# Altium schematic sheet smartpot第三版.SchDoc: Flowerpot
size A3
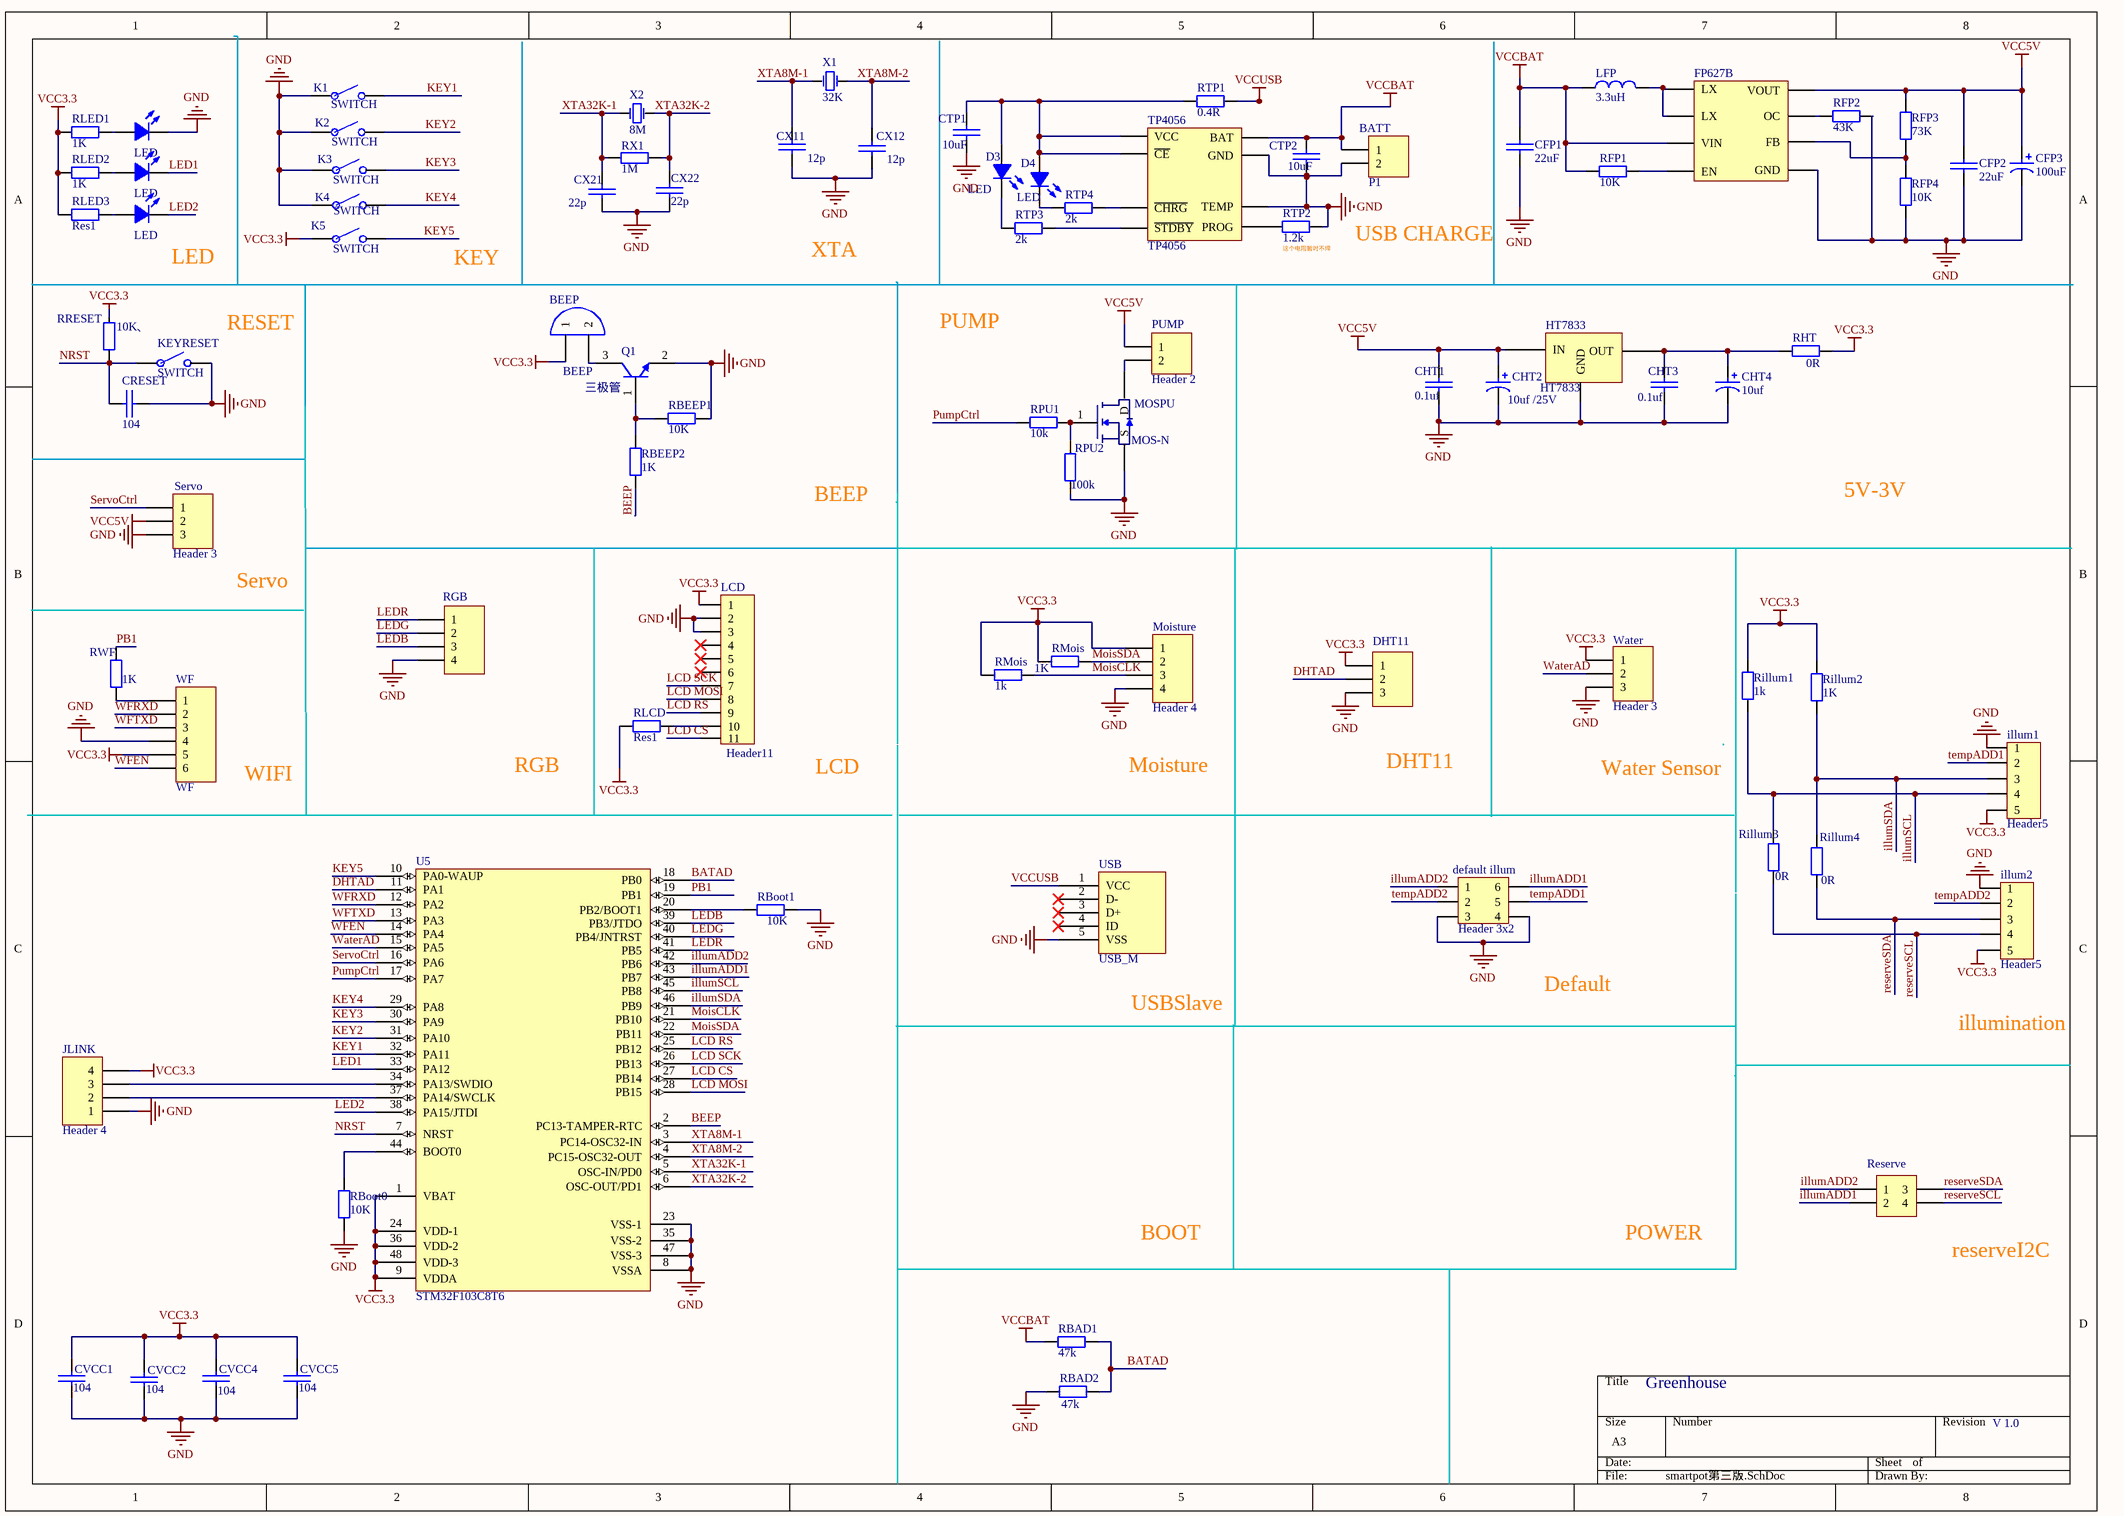
[diagram p0: smartpot第三版.SchDoc]

## Parts
(Parts that share a designator on the sheet are numbered #1, #2 ... from top to bottom, then left to right.)
BEEP  BEEP  [BEEP]
CFP1  22uF  [0603-1]
CFP2  22uF  [0603-1]
CFP3  100uF  [1206 - J]
CHT1  0.1uf  [0603-1]
CHT2  10uf /25V  [1206 - J]
CHT3  0.1uf  [0603-1]
CHT4  10uf  [1206 - J]
CRESET  104  [0603-1]
CTP1  10uF  [0603-1]
CTP2  10uF  [0603-1]
CVCC1  104  [0603-1]
CVCC2  104  [0603-1]
CVCC4  104  [0603-1]
CVCC5  104  [0603-1]
CX11  12p  [0603-1]
CX12  12p  [0603-1]
CX21  22p  [0603-1]
CX22  22p  [0603-1]
D1  LED  [LED-0805]
D2  LED  [LED-0805]
D3  LED  [LED-0805]
D4  LED  [LED-0805]
D5  LED  [LED-0805]
default_illum  Header 3x2  [HDR3X2 A]
DHT11  Header 3  [HDR3X1_DHT]  (value not drawn)
FP627B  (no value)  [NSO8_TP4056]
HT7833  HT7833  [SOT-89-3]
illum1  Header5  [HDR5x1 A1]
illum2  Header5  [HDR5x1 A1]
JLINK  Header 4  [header 4]
K1  SWITCH  [SWITCH-1]
K2  SWITCH  [SWITCH-1]
K3  SWITCH  [SWITCH-1]
K4  SWITCH  [SWITCH-1]
K5  SWITCH  [SWITCH-1]
KEYRESET  SWITCH  [SWITCH-1]
LCD  Header11  [HDR11X1_A]
LFP  3.3uH  [0805-1]
Moisture  Header 4  [header 4]
MOSPU  MOS-N  [SOT-23]
P1  BATT  [HDR2X1_A]
PUMP  Header 2  [HDR2X1_A]
Q1  三极管  [SOT-23]
RBAD1  47k  [0603]
RBAD2  47k  [0603]
RBEEP1  10K  [0603]
RBEEP2  1K  [0603]
RBoot0  value 10K  [0603]  (hidden comment: Res1)
RBoot1  value 10K  [0603]  (hidden comment: Res1)
Reserve  Header 2X2B  [HDR2X2_B]  (value not drawn)
RFP1  10K  [0603]
RFP2  43K  [0603]
RFP3  73K  [0603]
RFP4  10K  [0603]
RGB  Header 4  [HDR4X1_B2]  (value not drawn)
RHT  0R  [0603]
Rillum1  1k  [0603]
Rillum2  1K  [0603]
Rillum3  0R  [0603]
Rillum4  0R  [0603]
RLCD  Res1  [0603]
RLED1  1K  [0603]
RLED2  1K  [0603]
RLED3  Res1  [0603]
RMois#1  1K  [0603]
RMois#2  1k  [0603]
RPU1  10k  [0603]
RPU2  100k  [0603]
RRESET  10K、  [0603]
RTP1  0.4R  [0603]
RTP2  1.2k  [0603]
RTP3  2k  [0603]
RTP4  2k  [0603]
RWF  1K  [0603]
RX1  1M  [0603]
Servo  Header 3  [HDR3X1_A]
TP4056  TP4056  [NSO8_TP4056]
U5  STM32F103C8T6  [LQFP-48]
USB  USB_M  [USB_MICRO]
Water  Header 3  [HDR3X1_A]
WF  WF  [HDR6X1_WF]
X1  32K  [XTAL - Y]
X2  8M  [XTAL]

## Nets
GND: CFP1.1 CFP2.1 CFP3.2 CHT1.1 CHT2.2 CHT3.1 CHT4.2 CRESET.2 CTP1.1 CTP2.1 CVCC1.1 CVCC2.1 CVCC4.1 CVCC5.1 CX11.1 CX12.1 CX21.1 CX22.1 D1.2(K) default_illum.3 default_illum.4 DHT11.3 FP627B.5(GND) HT7833.1(GND) illum1.1 illum2.1 JLINK.1 K1.1 K2.1 K3.1 K4.1 KEYRESET.2 LCD.2 LCD.3 Moisture.4 MOSPU.2(S) P1.2 Q1.2(E) RBAD2.1 RBEEP1.1 RBoot0.1 RBoot1.2 RFP2.2 RFP4.1 RGB.4 RPU2.1 RTP2.2 Servo.3 TP4056.1(TEMP) TP4056.3(GND) U5.8(VSSA) U5.23(VSS-1) U5.35(VSS-2) U5.47(VSS-3) USB.5(VSS) Water.3 WF.4
VCC3.3: BEEP.1 CVCC1.2 CVCC2.2 CVCC4.2 CVCC5.2 DHT11.1 illum1.5 illum2.5 JLINK.4 K5.1 LCD.1 Moisture.1 RHT.2 Rillum1.2 Rillum2.2 RLCD.1 RLED1.1 RLED2.1 RLED3.1 RMois#1.1 RMois#2.2 RRESET.2 U5.1(VBAT) U5.9(VDDA) U5.24(VDD-1) U5.36(VDD-2) U5.48(VDD-3) Water.1 WF.5
VCC5V: CFP2.2 CFP3.1 CHT1.2 CHT2.1 FP627B.8(VOUT) HT7833.2(IN) PUMP.1 RFP3.2 Servo.2
VCCBAT: CFP1.2 CTP2.2 FP627B.3(VIN) LFP.1 P1.1 RBAD1.1 RFP1.1 TP4056.5(BAT)
VCCUSB: RTP1.2 USB.1(VCC)
BATAD: RBAD1.2 RBAD2.2 U5.18(PB0)
BEEP: RBEEP2.1 U5.2(PC13-TAMPER-RTC)
DHTAD: DHT11.2 U5.11(PA1)
illumADD1: default_illum.6 Reserve.2 U5.43(PB7)
illumADD2: default_illum.1 Reserve.1 U5.42(PB6)
illumSCL: illum1.4 Rillum1.1 Rillum3.2 U5.45(PB8)
illumSDA: illum1.3 Rillum2.1 Rillum4.2 U5.46(PB9)
KEY1: K1.2 U5.32(PA11)
KEY2: K2.2 U5.31(PA10)
KEY3: K3.2 U5.30(PA9)
KEY4: K4.2 U5.29(PA8)
KEY5: K5.2 U5.10(PA0-WAUP)
LCD CS: LCD.11 U5.27(PB14)
LCD MOSI: LCD.8 U5.28(PB15)
LCD RS: LCD.9 U5.25(PB12)
LCD SCK: LCD.7 U5.26(PB13)
LED1: D2.2(K) U5.33(PA12)
LED2: D5.2(K) U5.38(PA15/JTDI)
LEDB: RGB.3 U5.39(PB3/JTDO)
LEDG: RGB.2 U5.40(PB4/JNTRST)
LEDR: RGB.1 U5.41(PB5)
MoisCLK: Moisture.3 RMois#2.1 U5.21(PB10)
MoisSDA: Moisture.2 RMois#1.2 U5.22(PB11)
NRST: CRESET.1 KEYRESET.1 RRESET.1 U5.7(NRST)
PB1: RWF.2 U5.19(PB1)
PumpCtrl: RPU1.1 U5.17(PA7)
reserveSCL: illum2.4 Reserve.4 Rillum3.1
reserveSDA: illum2.3 Reserve.3 Rillum4.1
ServoCtrl: Servo.1 U5.16(PA6)
tempADD1: default_illum.5 illum1.2
tempADD2: default_illum.2 illum2.2
WaterAD: U5.15(PA5) Water.2
WFEN: U5.14(PA4) WF.6
WFRXD: U5.12(PA2) WF.2
WFTXD: U5.13(PA3) WF.3
XTA8M-1: CX11.2 U5.3(PC14-OSC32-IN) X1.1
XTA8M-2: CX12.2 U5.4(PC15-OSC32-OUT) X1.2
XTA32K-1: CX21.2 RX1.1 U5.5(OSC-IN/PD0) X2.1
XTA32K-2: CX22.2 RX1.2 U5.6(OSC-OUT/PD1) X2.2
NetBEEP_2: BEEP.2 Q1.3(C)
NetCHT3_2: CHT3.2 CHT4.1 HT7833.3(OUT) RHT.1
NetCTP1_2: CTP1.2 D3.1(A) D4.1(A) RTP1.1 TP4056.4(VCC) TP4056.8(~{CE})
NetD1_1: D1.1(A) RLED1.2
NetD2_1: D2.1(A) RLED2.2
NetD3_2: D3.2(K) RTP3.1
NetD4_2: D4.2(K) RTP4.1
NetD5_1: D5.1(A) RLED3.2
NetFP627B_1: FP627B.1(LX) FP627B.2(LX) LFP.2
NetFP627B_4: FP627B.4(EN) RFP1.2
NetFP627B_6: FP627B.6(FB) RFP3.1 RFP4.2
NetFP627B_7: FP627B.7(OC) RFP2.1
NetJLINK_2: JLINK.2 U5.37(PA14/SWCLK)
NetJLINK_3: JLINK.3 U5.34(PA13/SWDIO)
NetLCD_10: LCD.10 RLCD.2
NetMOSPU_1: MOSPU.1(G) RPU1.2 RPU2.2
NetMOSPU_3: MOSPU.3(D) PUMP.2
NetQ1_1: Q1.1(B) RBEEP1.2 RBEEP2.2
NetRBoot0_2: RBoot0.2 U5.44(BOOT0)
NetRBoot1_1: RBoot1.1 U5.20(PB2/BOOT1)
NetRTP2_1: RTP2.1 TP4056.2(PROG)
NetRTP3_2: RTP3.2 TP4056.6(~{STDBY})
NetRTP4_2: RTP4.2 TP4056.7(~{CHRG})
NetRWF_1: RWF.1 WF.1

Not connected (* = marked no-connect by the designer): LCD 4* 5* 6*; USB 2(D-)* 3(D+)* 4(ID)*

## Notes on the sheet
- (near RTP2) 这个电阻暂时不焊
- USB CHARGE
- (near D5) LED
- KEY
- XTA
- (near KEYRESET) RESET
- PUMP
- BEEP
- 5V-3V
- Servo
- WIFI
- RGB
- LCD
- Moisture
- DHT11
- Water Sensor
- Default
- USBSlave
- illumination
- BOOT
- POWER
- (near Reserve) reserveI2C
- Greenhouse
- V 1.0

## Library data of the parts
CFP1 CFP2 CHT1 CHT3 CRESET CTP1 CTP2 CVCC1 CVCC2 CVCC4 CVCC5 CX11 CX12 CX21 CX22 = CAP: 无极性电容
CFP3 CHT2 CHT4 = CAP Pol: 极性电容
DHT11 Servo Water = Header 3: 接插件; LatestRevisionDate: 17-Jul-2002; LatestRevisionNote: Re-released for DXP Platform.; Publisher: Altium Limited
FP627B = FP627
JLINK Moisture = Header 4: header,4pin
LFP = Inductance: 电感
P1 PUMP = Header 2: 接插件; LatestRevisionDate: 17-Jul-2002; LatestRevisionNote: Re-released for DXP Platform.; Publisher: Altium Limited
Q1 = BCP68: NPN三极管; Published: 17-Sep-2003; LatestRevisionDate: 12-Dec-2006; LatestRevisionNote: IPC-7351 Footprint Added.; DatasheetVersion: 8-Apr-1999; PackageVersion: Aug-2001; PackageReference: SOT223; Publisher: Altium Limited; PackageDescription: 4-Pin SOT-223 Package 2.3 mm Pitch, 7 mm Lead Span; ComponentLink1Description: Manufacturer Link; ComponentLink1URL: http://www.semiconductors.philips.com/; ComponentLink2Description: Datasheet; ComponentLink2URL: http://www.semiconductors.philips.com/acrobat/datasheets/BCP68_4.pdf
RBAD1 RBAD2 RBEEP1 RBEEP2 RBoot0 RBoot1 RFP1-RFP4 RHT Rillum1-Rillum4 RLCD RLED1-RLED3 RMois#1 RMois#2 RPU1 RPU2 RRESET RTP1-RTP4 RWF RX1 = Res1: 电阻
  RBAD1 RBAD2 RBEEP1 RBEEP2 RFP1-RFP4 RHT Rillum1-Rillum4 RLCD RLED1-RLED3 RMois#1 RMois#2 RPU1 RPU2 RRESET RTP1-RTP4 RWF RX1: Value: *
Reserve = Header 2X2B: 接插件; LatestRevisionDate: 17-Jul-2002; LatestRevisionNote: Re-released for DXP Platform.; Publisher: Altium Limited
RGB = Header 4_1: 接插件; LatestRevisionDate: 17-Jul-2002; LatestRevisionNote: Re-released for DXP Platform.; Publisher: Altium Limited
USB = USB_M: MicroUSB接口
WF = Header 6: 接插件; LatestRevisionDate: 17-Jul-2002; LatestRevisionNote: Re-released for DXP Platform.; Publisher: Altium Limited
X1 X2 = XTAL